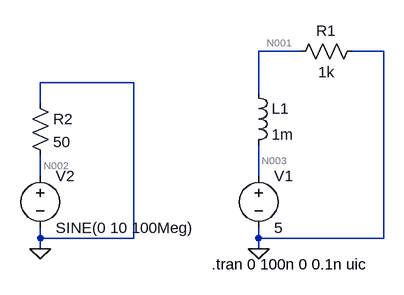
[diagram p0: schematic Test.asc]
Test.asc, the LTspice schematic file:
Version 4
SHEET 1 880 680
WIRE 240 16 176 16
WIRE 368 16 320 16
WIRE -16 64 -160 64
WIRE 176 80 176 16
WIRE -160 96 -160 64
WIRE -160 208 -160 176
WIRE 176 208 176 160
WIRE -160 304 -160 288
WIRE -16 304 -16 64
WIRE -16 304 -160 304
WIRE 176 304 176 288
WIRE 368 304 368 16
WIRE 368 304 176 304
WIRE -160 320 -160 304
WIRE 176 320 176 304
FLAG 176 320 0
FLAG -160 320 0
SYMBOL voltage 176 192 R0
WINDOW 123 0 0 Left 0
WINDOW 39 0 0 Left 0
SYMATTR InstName V1
SYMATTR Value 5
SYMBOL ind 160 64 R0
SYMATTR InstName L1
SYMATTR Value 1m
SYMBOL res 336 0 R90
WINDOW 0 0 56 VBottom 2
WINDOW 3 32 56 VTop 2
SYMATTR InstName R1
SYMATTR Value 1k
SYMBOL voltage -160 192 R0
WINDOW 123 0 0 Left 0
WINDOW 39 0 0 Left 0
SYMATTR InstName V2
SYMATTR Value SINE(0 10 100Meg)
SYMBOL res -176 80 R0
SYMATTR InstName R2
SYMATTR Value 50
TEXT 104 344 Left 2 !.tran 0 100n 0 0.1n uic

The netlist it stands for:
* Test.asc
V1 N003 0 5
L1 N001 N003 1m
R1 0 N001 1k
V2 N002 0 SINE(0 10 100Meg)
R2 0 N002 50
.tran 0 100n 0 0.1n uic
.backanno
.end

* Results of the author's LTspice run, read from the files saved beside the schematic
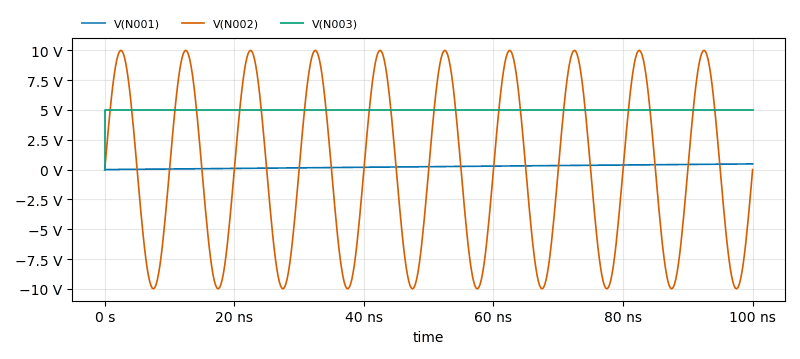
[diagram p1: Transient Analysis of Test.asc, plotted from the saved traces]
* Transient Analysis, 1 run:
*   V(N001): min 0 V, max 475.8 mV, average 241.9 mV, rms 278.1 mV, last 475.8 mV
*   V(N002): min -9.998 V, max 9.998 V, average 0 V, rms 7.071 V, last 0 V
*   V(N003): min 0 V, max 5 V, average 5 V, rms 5 V, last 5 V